# Altium project PFE_rec.PrjPCB
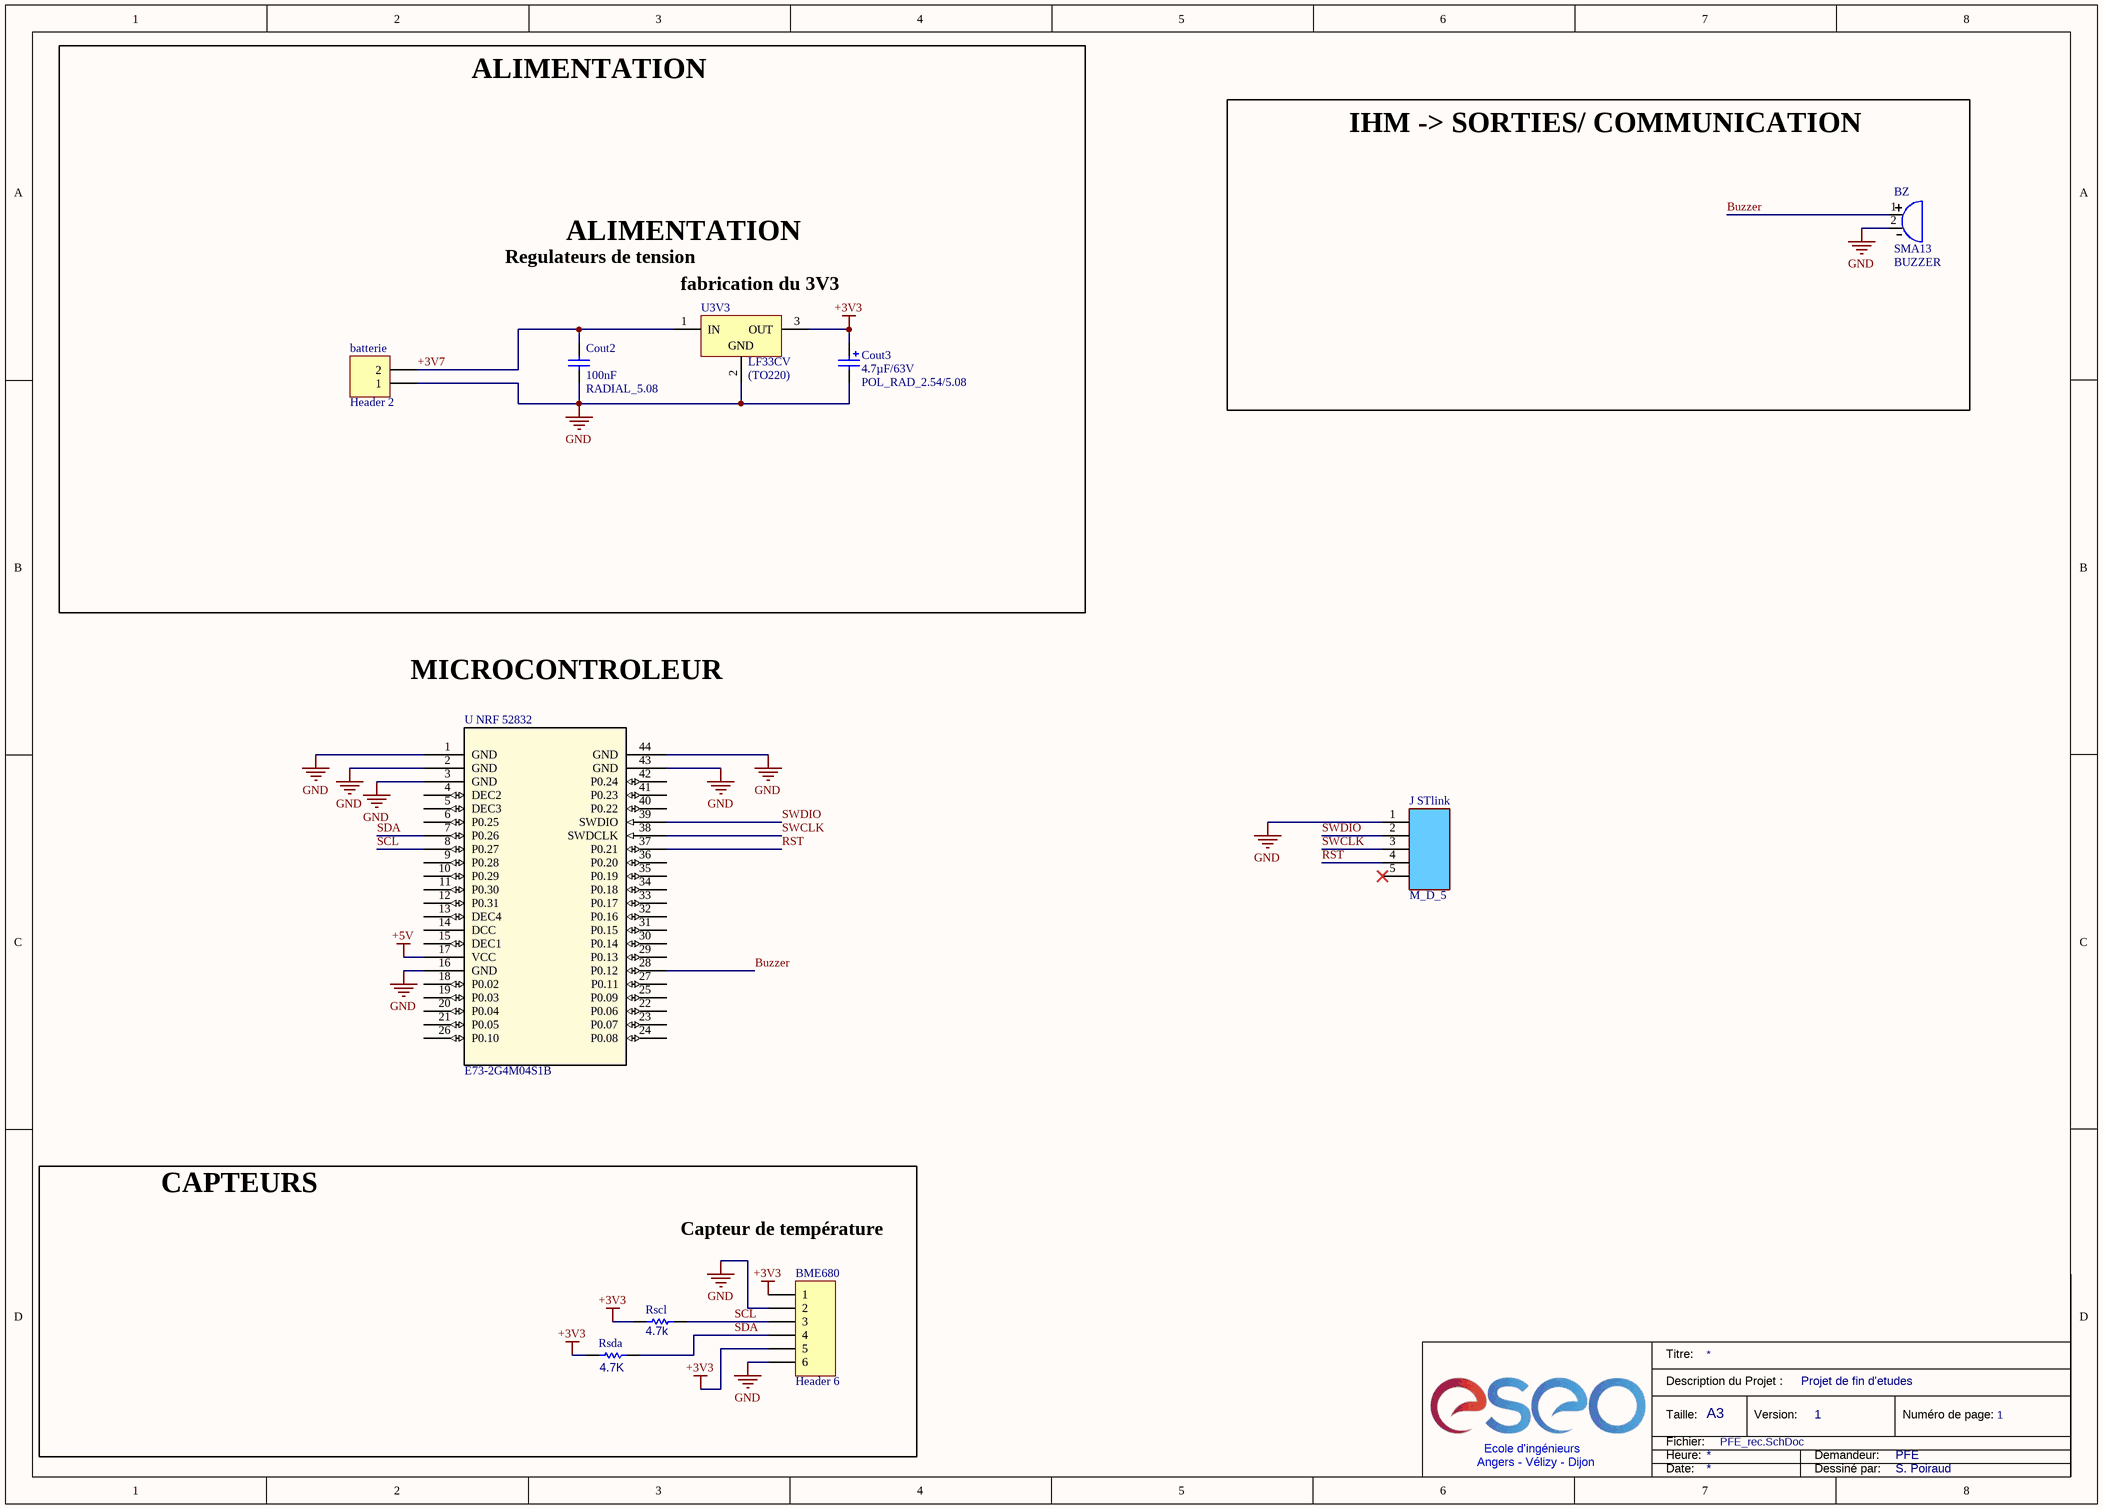
[diagram p0: PFE_rec.SchDoc]
1 sheet, 10 parts. Net scope: global (net labels, ports and power ports of the same name join across sheets).
Board file: PFE_rec.PCBDOC

## Sheet PFE_rec.SchDoc
size A3

### Parts
batterie  Header 2  [HDR1X2]
BME680  Header 6  [HDR1X6]
BZ  value SMA13  Type: BUZZER  [BUZZER_SMA13]  (hidden comment: BUZZER_SMA13)
Cout2  value 100nF  Type: RADIAL_5.08  [CONDENSATEUR_CERAMIQUE_RADIAL_5.08]  (hidden comment: CONDENSATEUR_CER_RAD_5.08)
Cout3  value 4.7µF/63V  Type: POL_RAD_2.54/5.08  [CONDENSATEUR_POLARISE_ELECTROLYTIQUE_RADIAL_2.54/5.08]  (hidden comment: CONDENSATEUR_POL_ELECTROLY_RAD_2.54/5.08)
J_STlink  Type: M_D_5  [BARRETTE_5_M_D]  (hidden comment: BARRETTE_5 CONTACTS_1 RANGEE_MALE_DROITE)
Rscl  value 4.7k  [RESISTANCE_1/4W]  (hidden comment: RESISTANCE_AXIALE_1/4W)
Rsda  value 4.7K  [RESISTANCE_1/4W]  (hidden comment: RESISTANCE_AXIALE_1/4W)
U3V3  Type: LF33CV  Package: (TO220)  [REGULATEUR_TO220_78XX]  (hidden comment: REGULATEUR_TO220_78XX)
U_NRF_52832  E73-2G4M04S1B  [E73-2G4M04S1B_BYT]

### Blocks framed on the sheet
IHM -> SORTIES/ COMMUNICATION: BZ
CAPTEURS: BME680 Rscl Rsda

### Nets
+3V3: BME680.1 BME680.5 Cout3.1 Rscl.1 Rsda.1 U3V3.3(OUT)
+5V: U_NRF_52832.17(VCC)
GND: batterie.1 BME680.2 BME680.6 BZ.2 Cout2.1 Cout3.2 J_STlink.1 U3V3.2(GND) U_NRF_52832.1(GND) U_NRF_52832.2(GND) U_NRF_52832.3(GND) U_NRF_52832.16(GND) U_NRF_52832.43(GND) U_NRF_52832.44(GND)
+3V7: batterie.2 Cout2.2 U3V3.1(IN)
Buzzer: BZ.1 U_NRF_52832.28(P0.12)
RST: J_STlink.4 U_NRF_52832.37(P0.21)
SCL: BME680.3 Rscl.2 U_NRF_52832.8(P0.27)
SDA: BME680.4 Rsda.2 U_NRF_52832.7(P0.26)
SWCLK: J_STlink.3 U_NRF_52832.38(SWDCLK)
SWDIO: J_STlink.2 U_NRF_52832.39(SWDIO)

Not connected (* = marked no-connect by the designer): J_STlink 5*; U_NRF_52832 4(DEC2) 5(DEC3) 6(P0.25) 9(P0.28) 10(P0.29) 11(P0.30) 12(P0.31) 13(DEC4) 14(DCC) 15(DEC1) 18(P0.02) 19(P0.03) 20(P0.04) 21(P0.05) 22(P0.06) 23(P0.07) 24(P0.08) 25(P0.09) 26(P0.10) 27(P0.11) 29(P0.13) 30(P0.14) 31(P0.15) 32(P0.16) 33(P0.17) 34(P0.18) 35(P0.19) 36(P0.20) 40(P0.22) 41(P0.23) 42(P0.24)

### Notes on the sheet
- ALIMENTATION
- Regulateurs de tension
- (near U3V3) fabrication du 3V3
- MICROCONTROLEUR
- Capteur de température
- Titre:
- Description du Projet :
- Projet de fin d'etudes
- Ecole d'ingénieurs
- Taille:
- Heure:
- Fichier:
- A3
- Version:
- 1
- Demandeur:
- PFE
- Numéro de page:
- Angers - Vélizy - Dijon
- Date:
- Dessiné par:
- S. Poiraud

### Library data of the parts
batterie = Header 2: Header, 2-Pin; LatestRevisionDate: 17-Jul-2002; LatestRevisionNote: Re-released for DXP Platform.; Publisher: Altium Limited
BME680 = Header 6: Header, 6-Pin; LatestRevisionDate: 17-Jul-2002; LatestRevisionNote: Re-released for DXP Platform.; Publisher: Altium Limited
BZ = BUZZER_SMA13: BUZZER SMA13
Cout2 = CONDENSATEUR_CER_RAD_5.08: CONDENSATEUR TRAVERSANT CERAMIQUE RADIAL 5.08mm
Cout3 = CONDENSATEUR_POL_ELECTROLY_RAD_2.54/5.08: CONDENSATEUR POLARISE ELECTROLYTIQUE RADIAL 2.54/5.08
J_STlink = BARRETTE_5 CONTACTS_1 RANGEE_MALE_DROITE: BARRETTE 5 CONTACTS 1 RANGEE MALE DROITE
Rscl Rsda = RESISTANCE_AXIALE_1/4W: RESISTANCE TRAVERSANTE AXIALE 1/4W; Type: 1/4W
U3V3 = REGULATEUR_TO220_78XX: REGULATEUR DE TENSION POSITIVE 78XX BOITIER TO220
U_NRF_52832 = E73-2G4M04S1B: No Description Available; Mfr_Name: Chengdu Ebyte Elec Tech; RefDes: RefDes; Type: Type